# Altium schematic sheet Selector_POT_Maestro.SchDoc
size A4; SheetNumber: 16; SheetTotal: 17
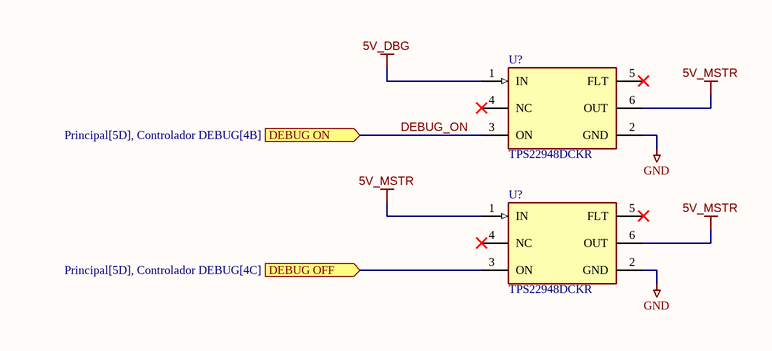
[diagram p0: Selector_POT_Maestro.SchDoc]

## Parts
(Parts that share a designator on the sheet are numbered #1, #2 ... from top to bottom, then left to right.)
U?#1  TPS22948DCKR  [FP-DCK0006A-MFG]
U?#2  TPS22948DCKR  [FP-DCK0006A-MFG]

## Ports
DEBUG OFF (in, see Principal[5D], Controlador DEBUG[4C]), DEBUG ON (in, see Principal[5D], Controlador DEBUG[4B])

## Nets
5V_DBG: U?#1.1(IN)
5V_MSTR: U?#1.6(OUT) U?#2.1(IN) U?#2.6(OUT)
GND: U?#1.2(GND) U?#2.2(GND)
DEBUG OFF: U?#2.3(ON) ; port DEBUG OFF
DEBUG_ON: U?#1.3(ON) ; port DEBUG ON

Not connected (* = marked no-connect by the designer): U?#1 4(NC)* 5(FLT)*; U?#2 4(NC)* 5(FLT)*

## Library data of the parts
U?#1 U?#2 = CMP-04910-000046-1: IC POWER MANAGEMENT